# Altium project TempHum_ed_r_SN_20.PrjPcb
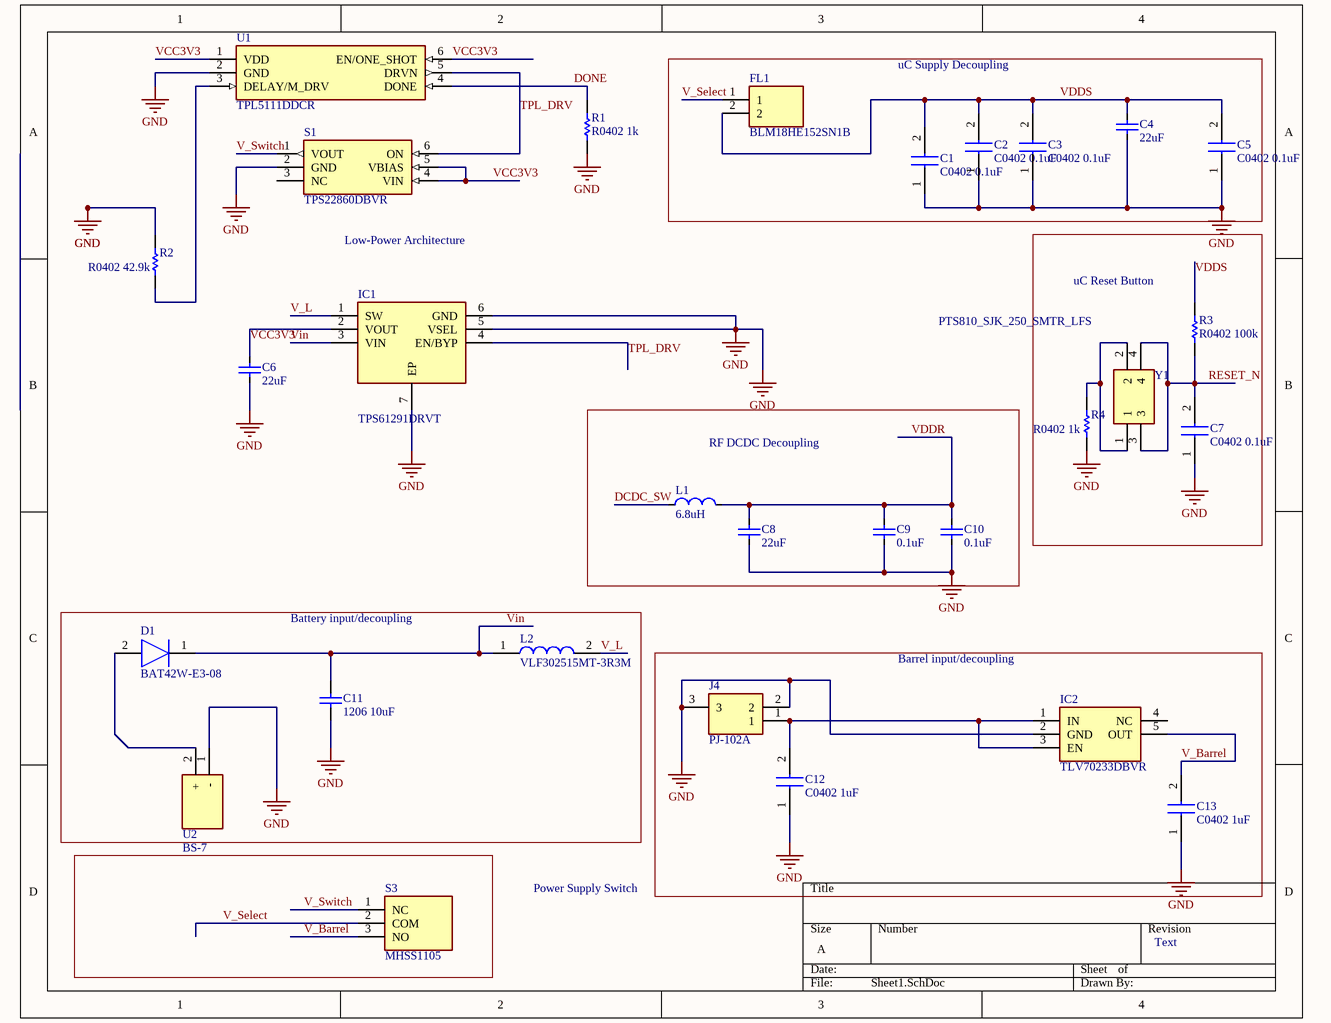
[diagram p0: Sheet1.SchDoc]
3 sheets, 46 parts. Net scope: global (net labels, ports and power ports of the same name join across sheets).
Board file: PCB1.PcbDoc
Sheets:
  Sheet1.SchDoc
  Sheet2.SchDoc
  Sheet3.SchDoc

## Sheet Sheet1.SchDoc
size A

### Parts
C1  C0402 0.1uF  [CAPC0603X33N]
C2  C0402 0.1uF  [CAPC0603X33N]
C3  C0402 0.1uF  [CAPC0603X33N]
C4  value 22uF  [PASSIVE-CAPACITOR-0603]
C5  C0402 0.1uF  [CAPC0603X33N]
C6  value 22uF  [PASSIVE-CAPACITOR-0603]  (hidden comment: Passive-Capacitor (Generic))
C7  C0402 0.1uF  [CAPC0603X33N]
C8  value 22uF  [PASSIVE-CAPACITOR-0603]
C9  value 0.1uF  [PASSIVE-CAPACITOR-0603]  (hidden comment: Passive-Capacitor (Generic))
C10  value 0.1uF  [PASSIVE-CAPACITOR-0603]  (hidden comment: Passive-Capacitor (Generic))
C11  1206 10uF  [KEMT-1206-2_M]
C12  C0402 1uF  [CAPC0603X33N]
C13  C0402 1uF  [CAPC0603X33N]
D1  BAT42W-E3-08  [SOD3716X135N]
FL1  BLM18HE152SN1B  [BEADC1608X95N]
IC1  TPS61291DRVT  [SON65P200X200X80-7N]
IC2  TLV70233DBVR  [SOT95P280X145-5N]
J4  PJ-102A  [PJ-102AH]
L1  value 6.8uH  [PASSIVE-INDUCTOR-0603]  (hidden comment: Passive-Inductor (Generic))
L2  VLF302515MT-3R3M  [VLF302515MT]
R1  R0402 1k  [RESC1005X40X25NL05T05]
R2  R0402 42.9k  [RESC1005X40X25NL05T05]
R3  R0402 100k  [RESC1005X40X25NL05T05]
R4  R0402 1k  [RESC1005X40X25NL05T05]
S1  TPS22860DBVR  [SOT95P280X145-6N]
S3  MHSS1105  [MHSS1105]
U1  TPL5111DDCR  [SOT95P280X110-6N]
U2  BS-7  [BS7]
Y1  PTS810_SJK_250_SMTR_LFS  [PTS810SJK250SMTRLFS]

### Blocks framed on the sheet
uC Supply Decoupling: C1-C5 FL1
uC Reset Button: C7 R3 R4 Y1
RF DCDC Decoupling: C8-C10 L1
Battery input/decoupling: C11 D1 L2 U2
Barrel input/decoupling: C12 C13 IC2 J4

### Nets
GND: C1.1 C2.1 C3.1 C4.2 C5.1 C6.1 C7.1 C8.2 C9.1 C10.1 C11.1 C12.1 C13.1 IC1.5(VSEL) IC1.6(GND) IC1.7(EP) IC2.2(GND) J4.2 J4.3 R1.1 R2.2 R4.1 S1.2(GND) U1.2(GND) U2.1(-)
DCDC_SW: L1.1
DONE: R1.2 U1.4(DONE)
RESET_N: C7.2 R3.1 Y1.3 Y1.4
TPL_DRV: IC1.4(EN/BYP) S1.6(ON) U1.5(DRVN)
V_Barrel: C13.2 IC2.5(OUT) S3.3(NO)
V_L: IC1.1(SW) L2.2
V_Select: FL1.1 S3.2(COM)
V_Switch: S1.1(VOUT) S3.1(NC)
VCC3V3: C6.2 IC1.2(VOUT) S1.4(VIN) S1.5(VBIAS) U1.1(VDD) U1.6(EN/ONE_SHOT)
VDDR: C8.1 C9.2 C10.2 L1.2
VDDS: C1.2 C2.2 C3.2 C4.1 C5.2 FL1.2 R3.2
Vin: C11.2 D1.1(K) IC1.3(VIN) L2.1
NetC12_2: C12.2 IC2.1(IN) IC2.3(EN) J4.1
NetD1_2: D1.2(A) U2.2(+)
NetR2_1: R2.1 U1.3(DELAY/M_DRV)
NetR4_2: R4.2 Y1.1 Y1.2

Not connected (* = marked no-connect by the designer): IC2 4(NC); S1 3(NC)

### Notes on the sheet
- Low-Power Architecture
- Power Supply Switch
- Text

### Library data of the parts
C1-C3 C5 C7 C12 C13 = 02014D474MAT2A: Capacitor; Manufacturer_Name: AVX; Datasheet Link: http://www.mouser.com/catalog/supplier/library/pdf/AVXSurfaceMountCeramic.pdf; Height: 0.33mm; Manufacturer_Part_Number: 02014D474MAT2A; Mouser Part Number: 581-02014D474MAT2A; Mouser Price/Stock: https://www.mouser.com/Search/Refine.aspx?Keyword=581-02014D474MAT2A
C4 C6 C8-C10 = Passive-Capacitor (Generic): Generic Capacitor; Category: Passive; Manufacturer: *; Manufacturer Part Number: *; Supplier 2: Digi-Key; Package: *; Through Hole (y/n): *; Supplier 1: Mouser; Supplier Part Number 1: *; Supplier Part Number 2: *
C11 = CMP-2000-05169-1: CAP, Ceramic, 0.1 uF, +/- 10%, 50 V, -55 to 125 degC, 1206 (3216 Metric), RoHS, Tape and Reel; Manufacturer: Kemet; Voltage Rating: 50V; Capacitance: 0.1µF; Product Range: KEMET-CSeries; SVHC: ToBeAdvised; Dielectric Characteristic: X7R; Capacitor Case Style: 1206[3216Metric]; Package Reference: 1206-2; Package Description: 2-Leads SMD, Body 3.2 x 1.6 mm; Packaging: Tape&Reel; Operating Temperature Max: 125degC; Capacitance Tolerance: ±10%; Datasheet URL: https://datasheet.ciiva.com/6125/1725438-6125494.pdf; Manufacturer URL: http://www.kemet.com/; Operating Temperature Min: -55degC; Datasheet Version: Jul-13
D1 = BAT42W-E3-08: Diode; Manufacturer_Name: Vishay; Datasheet Link: http://www.vishay.com/docs/85661/bat42w.pdf; Height: 1.35mm; Manufacturer_Part_Number: BAT42W-E3-08; Mouser Part Number: 78-BAT42W-E3-08; Mouser Price/Stock: https://www.mouser.com/Search/Refine.aspx?Keyword=78-BAT42W-E3-08; RS Part Number: 1808601P; RS Price/Stock: http://uk.rs-online.com/web/p/products/1808601P
FL1 = BLM18HE152SN1B: Filter; Manufacturer_Name: Murata Electronics; Datasheet Link: https://www.murata.com/en-us/products/productdetail?partno=BLM18HE152SN1%23; Height: 0.95mm; Manufacturer_Part_Number: BLM18HE152SN1B; Mouser Part Number: N/A; Mouser Price/Stock: https://www.mouser.com/Search/Refine.aspx?Keyword=N%2FA
IC1 = TPS61291DRVT: Integrated Circuit; Manufacturer_Name: Texas Instruments; Datasheet Link: http://uk.rs-online.com/web/p/products/9143112P; Height: 0.8mm; Manufacturer_Part_Number: TPS61291DRVT; Mouser Part Number: 595-TPS61291DRVT; Mouser Price/Stock: https://www.mouser.com/Search/Refine.aspx?Keyword=595-TPS61291DRVT; RS Part Number: 9143112P; RS Price/Stock: http://uk.rs-online.com/web/p/products/9143112P
IC2 = TLV70233DBVR: Integrated Circuit; Manufacturer_Name: Texas Instruments; Datasheet Link: http://www.ti.com/lit/gpn/tlv702; Height: 1.45mm; Manufacturer_Part_Number: TLV70233DBVR; Mouser Part Number: 595-TLV70233DBVR; Mouser Price/Stock: https://www.mouser.com/Search/Refine.aspx?Keyword=595-TLV70233DBVR
J4 = PJ-102A: Connector; Manufacturer_Name: CUI; Datasheet Link: https://www.cui.com/product/resource/pj-102a.pdf; Manufacturer_Part_Number: PJ-102A; Mouser Part Number: 490-PJ-102A; Mouser Price/Stock: https://www.mouser.com/Search/Refine.aspx?Keyword=490-PJ-102A
L1 = Passive-Inductor (Generic): Generic Inductor; Category: Passive; Manufacturer: *; Supplier 2: Digi-Key; Manufacturer Part Number: *; Supplier 1: Mouser; Package: *; Supplier Part Number 1: *; Supplier Part Number 2: *; Through Hole (y/n): *
L2 = VLF302515MT-3R3M: Inductor; Manufacturer_Name: TDK; Datasheet Link: https://product.tdk.com/info/en/documents/wdcatalog/withdrawn_inductor_commercial_power_vlf302515mt_en.pdf; Manufacturer_Part_Number: VLF302515MT-3R3M; Mouser Part Number: 810-VLF302515MT-3R3M; Mouser Price/Stock: https://www.mouser.com/Search/Refine.aspx?Keyword=810-VLF302515MT-3R3M
R1-R4 = CMP-2002-08135-1: Manufacturer: Vishay Dale; Part Number: CRCW040210K0FKED
S1 = TPS22860DBVR: Switch; Manufacturer_Name: Texas Instruments; Datasheet Link: http://www.ti.com/lit/gpn/tps22860; Height: 1.45mm; Manufacturer_Part_Number: TPS22860DBVR; Mouser Part Number: 595-TPS22860DBVR; Mouser Price/Stock: https://www.mouser.com/Search/Refine.aspx?Keyword=595-TPS22860DBVR
S3 = MHSS1105: Switch; Manufacturer_Name: Apem; Datasheet Link: https://componentsearchengine.com/Datasheets/2/MHSS1105.pdf; Height: 4mm; Manufacturer_Part_Number: MHSS1105; Mouser Part Number: 642-MHSS1105; Mouser Price/Stock: https://www.mouser.com/Search/Refine.aspx?Keyword=642-MHSS1105
U1 = TPL5111DDCR: Undefined or Miscellaneous; Manufacturer_Name: Texas Instruments; Datasheet Link: http://www.ti.com/lit/ds/symlink/tpl5111.pdf; Height: 1.1mm; Manufacturer_Part_Number: TPL5111DDCR; Mouser Part Number: 595-TPL5111DDCR; Mouser Price/Stock: https://www.mouser.com/Search/Refine.aspx?Keyword=595-TPL5111DDCR
U2 = BS-7: Undefined or Miscellaneous; Manufacturer_Name: MPD (Memory Protection Devices); Datasheet Link: http://www.memoryprotectiondevices.com/datasheets/BS-7-datasheet.pdf; Height: 9mm; Manufacturer_Part_Number: BS-7
Y1 = PTS810_SJK_250_SMTR_LFS: Crystal or Oscillator; Manufacturer_Name: C & K COMPONENTS; Manufacturer_Part_Number: PTS810 SJK 250 SMTR LFS; Datasheet Link: https://www.ckswitches.com/media/1476/pts810.pdf; Height: 2mm; Mouser Part Number: 611-PTS810SJK250SMTR; Mouser Price/Stock: https://www.mouser.com/Search/Refine.aspx?Keyword=611-PTS810SJK250SMTR

## Sheet Sheet2.SchDoc
size A
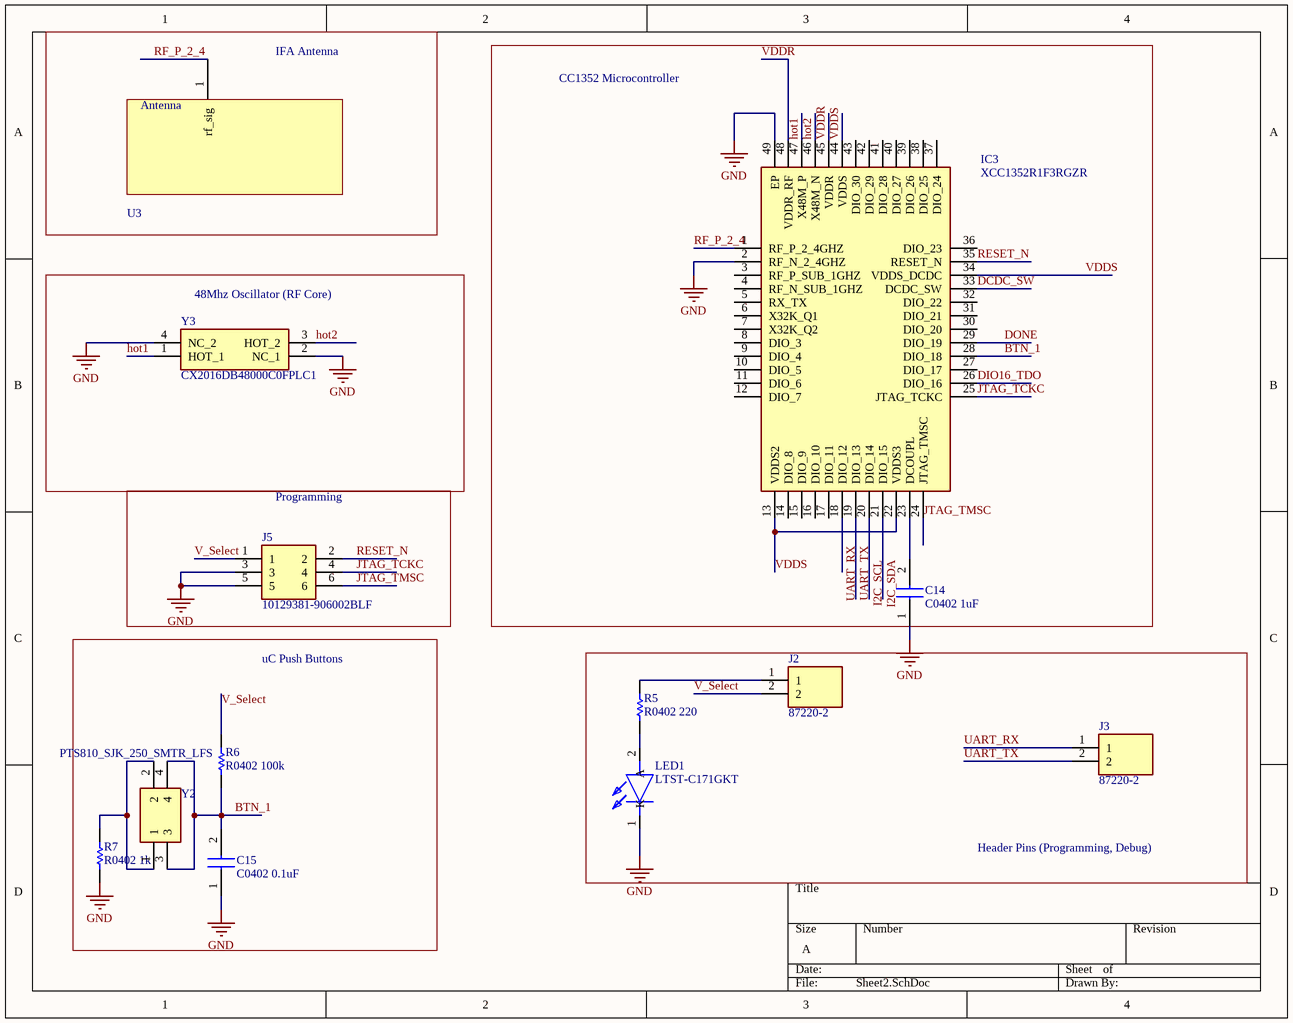
[diagram p1: Sheet2.SchDoc]

### Parts
C14  C0402 1uF  [CAPC0603X33N]
C15  C0402 0.1uF  [CAPC0603X33N]
IC3  XCC1352R1F3RGZR  [QFN50P700X700X100-49N-D]
J2  87220-2  [HDRV2W67P0X254_1X2_467X234X1083P]
J3  87220-2  [HDRV2W67P0X254_1X2_467X234X1083P]
J5  10129381-906002BLF  [HDRV6W67P254_2X3_762X483X858P]
LED1  LTST-C171GKT  [LEDC2012X90N]
R5  R0402 220  [RESC1005X40X25NL05T05]
R6  R0402 100k  [RESC1005X40X25NL05T05]
R7  R0402 1k  [RESC1005X40X25NL05T05]
U3  RF_ANTENNA_2  [RF_TRACE_ANTENNA_2]  (value not drawn)
Y2  PTS810_SJK_250_SMTR_LFS  [PTS810SJK250SMTRLFS]
Y3  CX2016DB48000C0FPLC1  [CX2016DB48000C0FPLC1]

### Blocks framed on the sheet
IFA Antenna: U3
CC1352 Microcontroller: C14 IC3
48Mhz Oscillator (RF Core): Y3
Programming: J5
uC Push Buttons: C15 R6 R7 Y2
Header Pins (Programming, Debug): J2 J3 LED1 R5

### Nets
GND: C14.1 C15.1 IC3.2(RF_N_2_4GHZ) IC3.49(EP) J5.3 J5.5 LED1.1(K) R7.1 Y3.2(NC_1) Y3.4(NC_2)
BTN_1: C15.2 IC3.28(DIO_18) R6.1 Y2.3 Y2.4
DCDC_SW: IC3.33(DCDC_SW)
DIO16_TDO: IC3.26(DIO_16)
DONE: IC3.29(DIO_19)
hot1: IC3.47(X48M_P) Y3.1(HOT_1)
hot2: IC3.46(X48M_N) Y3.3(HOT_2)
I2C_SCL: IC3.20(DIO_14)
I2C_SDA: IC3.21(DIO_15)
JTAG_TCKC: IC3.25(JTAG_TCKC) J5.4
JTAG_TMSC: IC3.24(JTAG_TMSC) J5.6
RESET_N: IC3.35(RESET_N) J5.2
RF_P_2_4: IC3.1(RF_P_2_4GHZ) U3.1(rf_sig)
UART_RX: IC3.18(DIO_12) J3.1
UART_TX: IC3.19(DIO_13) J3.2
V_Select: J2.2 J5.1 R6.2
VDDR: IC3.45(VDDR) IC3.48(VDDR_RF)
VDDS: IC3.13(VDDS2) IC3.22(VDDS3) IC3.34(VDDS_DCDC) IC3.44(VDDS)
NetC14_2: C14.2 IC3.23(DCOUPL)
NetJ2_1: J2.1 R5.2
NetLED1_2: LED1.2(A) R5.1
NetR7_2: R7.2 Y2.1 Y2.2

Not connected (* = marked no-connect by the designer): IC3 3(RF_P_SUB_1GHZ) 4(RF_N_SUB_1GHZ) 5(RX_TX) 6(X32K_Q1) 7(X32K_Q2) 8(DIO_3) 9(DIO_4) 10(DIO_5) 11(DIO_6) 12(DIO_7) 14(DIO_8) 15(DIO_9) 16(DIO_10) 17(DIO_11) 27(DIO_17) 30(DIO_20) 31(DIO_21) 32(DIO_22) 36(DIO_23) 37(DIO_24) 38(DIO_25) 39(DIO_26) 40(DIO_27) 41(DIO_28) 42(DIO_29) 43(DIO_30)

### Notes on the sheet
- (in symbol RF_ANTENNA_2) Antenna

### Library data of the parts
C14 C15 = 02014D474MAT2A: Capacitor; Manufacturer_Name: AVX; Datasheet Link: http://www.mouser.com/catalog/supplier/library/pdf/AVXSurfaceMountCeramic.pdf; Height: 0.33mm; Manufacturer_Part_Number: 02014D474MAT2A; Mouser Part Number: 581-02014D474MAT2A; Mouser Price/Stock: https://www.mouser.com/Search/Refine.aspx?Keyword=581-02014D474MAT2A
IC3 = XCC1352R1F3RGZR: Integrated Circuit; Manufacturer_Name: Texas Instruments; Datasheet Link: http://www.ti.com/lit/gpn/cc1352r; Height: 1mm; Manufacturer_Part_Number: XCC1352R1F3RGZR
J2 J3 = 87220-2: Connector; Manufacturer_Name: TE Connectivity; Allied_Number: 70082840; Datasheet Link: https://www.te.com/commerce/DocumentDelivery/DDEController?Action=showdoc&DocId=Customer+Drawing%7F87220%7FK3%7Fpdf%7FEnglish%7FENG_CD_87220_K3.pdf%7F87220-2; Height: 10.83mm; Manufacturer_Part_Number: 87220-2; Mouser Part Number: 571-872202; Mouser Price/Stock: https://www.mouser.com/Search/Refine.aspx?Keyword=571-872202; RS Part Number: 7202418P; RS Price/Stock: http://uk.rs-online.com/web/p/products/7202418P; Allied Price/Stock: https://www.alliedelec.com/teconnectivity-87220-2/70082840/
J5 = 10129381-906002BLF: Connector; Manufacturer_Name: Amphenol; Datasheet Link: https://componentsearchengine.com/Datasheets/1/10129381-906002BLF.pdf; Height: 8.58mm; Manufacturer_Part_Number: 10129381-906002BLF; Mouser Part Number: 649-1012938190602BLF; Mouser Price/Stock: https://www.mouser.com/Search/Refine.aspx?Keyword=649-1012938190602BLF
LED1 = LTST-C171GKT: LED; Manufacturer_Name: Lite-On; Datasheet Link: https://media.digikey.com/pdf/Data%20Sheets/Lite-On%20PDFs/LTST-C171GKT.pdf; Height: 0.9mm; Manufacturer_Part_Number: LTST-C171GKT; Mouser Part Number: 859-LTST-C171GKT; Mouser Price/Stock: https://www.mouser.com/Search/Refine.aspx?Keyword=859-LTST-C171GKT; RS Part Number: 6920935P; RS Price/Stock: http://uk.rs-online.com/web/p/products/6920935P
R5-R7 = CMP-2002-08135-1: as R1 on sheet Sheet1
Y2 = PTS810_SJK_250_SMTR_LFS: as Y1 on sheet Sheet1; Datasheet Link: https://www.ckswitches.com/media/1476/pts810.pdf; Height: 2mm; Mouser Part Number: 611-PTS810SJK250SMTR; Mouser Price/Stock: https://www.mouser.com/Search/Refine.aspx?Keyword=611-PTS810SJK250SMTR
Y3 = CX2016DB48000C0FPLC1: Crystal or Oscillator; Manufacturer_Name: Kyocera Electronic Components; Datasheet Link: https://componentsearchengine.com/Datasheets/1/CX2016DB48000C0FPLC1.pdf; Manufacturer_Part_Number: CX2016DB48000C0FPLC1; Mouser Part Number: 581-CX2016DB48CFPLC1; Mouser Price/Stock: https://www.mouser.com/Search/Refine.aspx?Keyword=581-CX2016DB48CFPLC1

## Sheet Sheet3.SchDoc
size A
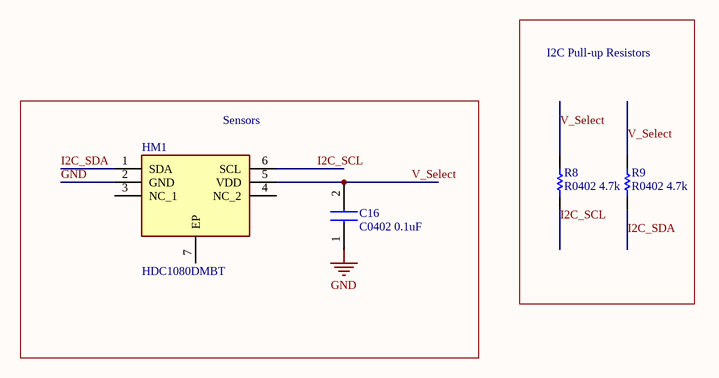
[diagram p2: Sheet3.SchDoc]

### Parts
C16  C0402 0.1uF  [CAPC0603X33N]
HM1  HDC1080DMBT  [SON100P300X300X80-7N]
R8  R0402 4.7k  [RESC1005X40X25NL05T05]
R9  R0402 4.7k  [RESC1005X40X25NL05T05]

### Blocks framed on the sheet
I2C Pull-up Resistors: R8 R9
Sensors: C16 HM1

### Nets
GND: C16.1 HM1.2(GND)
I2C_SCL: HM1.6(SCL) R8.1
I2C_SDA: HM1.1(SDA) R9.1
V_Select: C16.2 HM1.5(VDD) R8.2 R9.2

Not connected (* = marked no-connect by the designer): HM1 3(NC_1) 4(NC_2) 7(EP)

### Library data of the parts
C16 = 02014D474MAT2A: Capacitor; Manufacturer_Name: AVX; Datasheet Link: http://www.mouser.com/catalog/supplier/library/pdf/AVXSurfaceMountCeramic.pdf; Height: 0.33mm; Manufacturer_Part_Number: 02014D474MAT2A; Mouser Part Number: 581-02014D474MAT2A; Mouser Price/Stock: https://www.mouser.com/Search/Refine.aspx?Keyword=581-02014D474MAT2A
HM1 = HDC1080DMBT: Hygrometer; Manufacturer_Name: Texas Instruments; Datasheet Link: http://www.mouser.com/ds/2/405/hdc1080-844688.pdf; Height: 0.8mm; Manufacturer_Part_Number: HDC1080DMBT; Mouser Part Number: 595-HDC1080DMBT; Mouser Price/Stock: https://www.mouser.com/Search/Refine.aspx?Keyword=595-HDC1080DMBT; RS Part Number: 1330170P; RS Price/Stock: http://uk.rs-online.com/web/p/products/1330170P
R8 R9 = CMP-2002-08135-1: as R1 on sheet Sheet1

## Nets that join several sheets
GND: Sheet1 (25 pins), Sheet2 (10 pins), Sheet3 (C16.1 HM1.2)
DCDC_SW: Sheet1 (L1.1), Sheet2 (IC3.33)
DONE: Sheet1 (R1.2 U1.4), Sheet2 (IC3.29)
I2C_SCL: Sheet2 (IC3.20), Sheet3 (HM1.6 R8.1)
I2C_SDA: Sheet2 (IC3.21), Sheet3 (HM1.1 R9.1)
RESET_N: Sheet1 (C7.2 R3.1 Y1.3 Y1.4), Sheet2 (IC3.35 J5.2)
V_Select: Sheet1 (FL1.1 S3.2), Sheet2 (J2.2 J5.1 R6.2), Sheet3 (C16.2 HM1.5 R8.2 R9.2)
VDDR: Sheet1 (C8.1 C9.2 C10.2 L1.2), Sheet2 (IC3.45 IC3.48)
VDDS: Sheet1 (7 pins), Sheet2 (IC3.13 IC3.22 IC3.34 IC3.44)